# EAGLE design cp300_frehd (EAGLE 9.5.1)
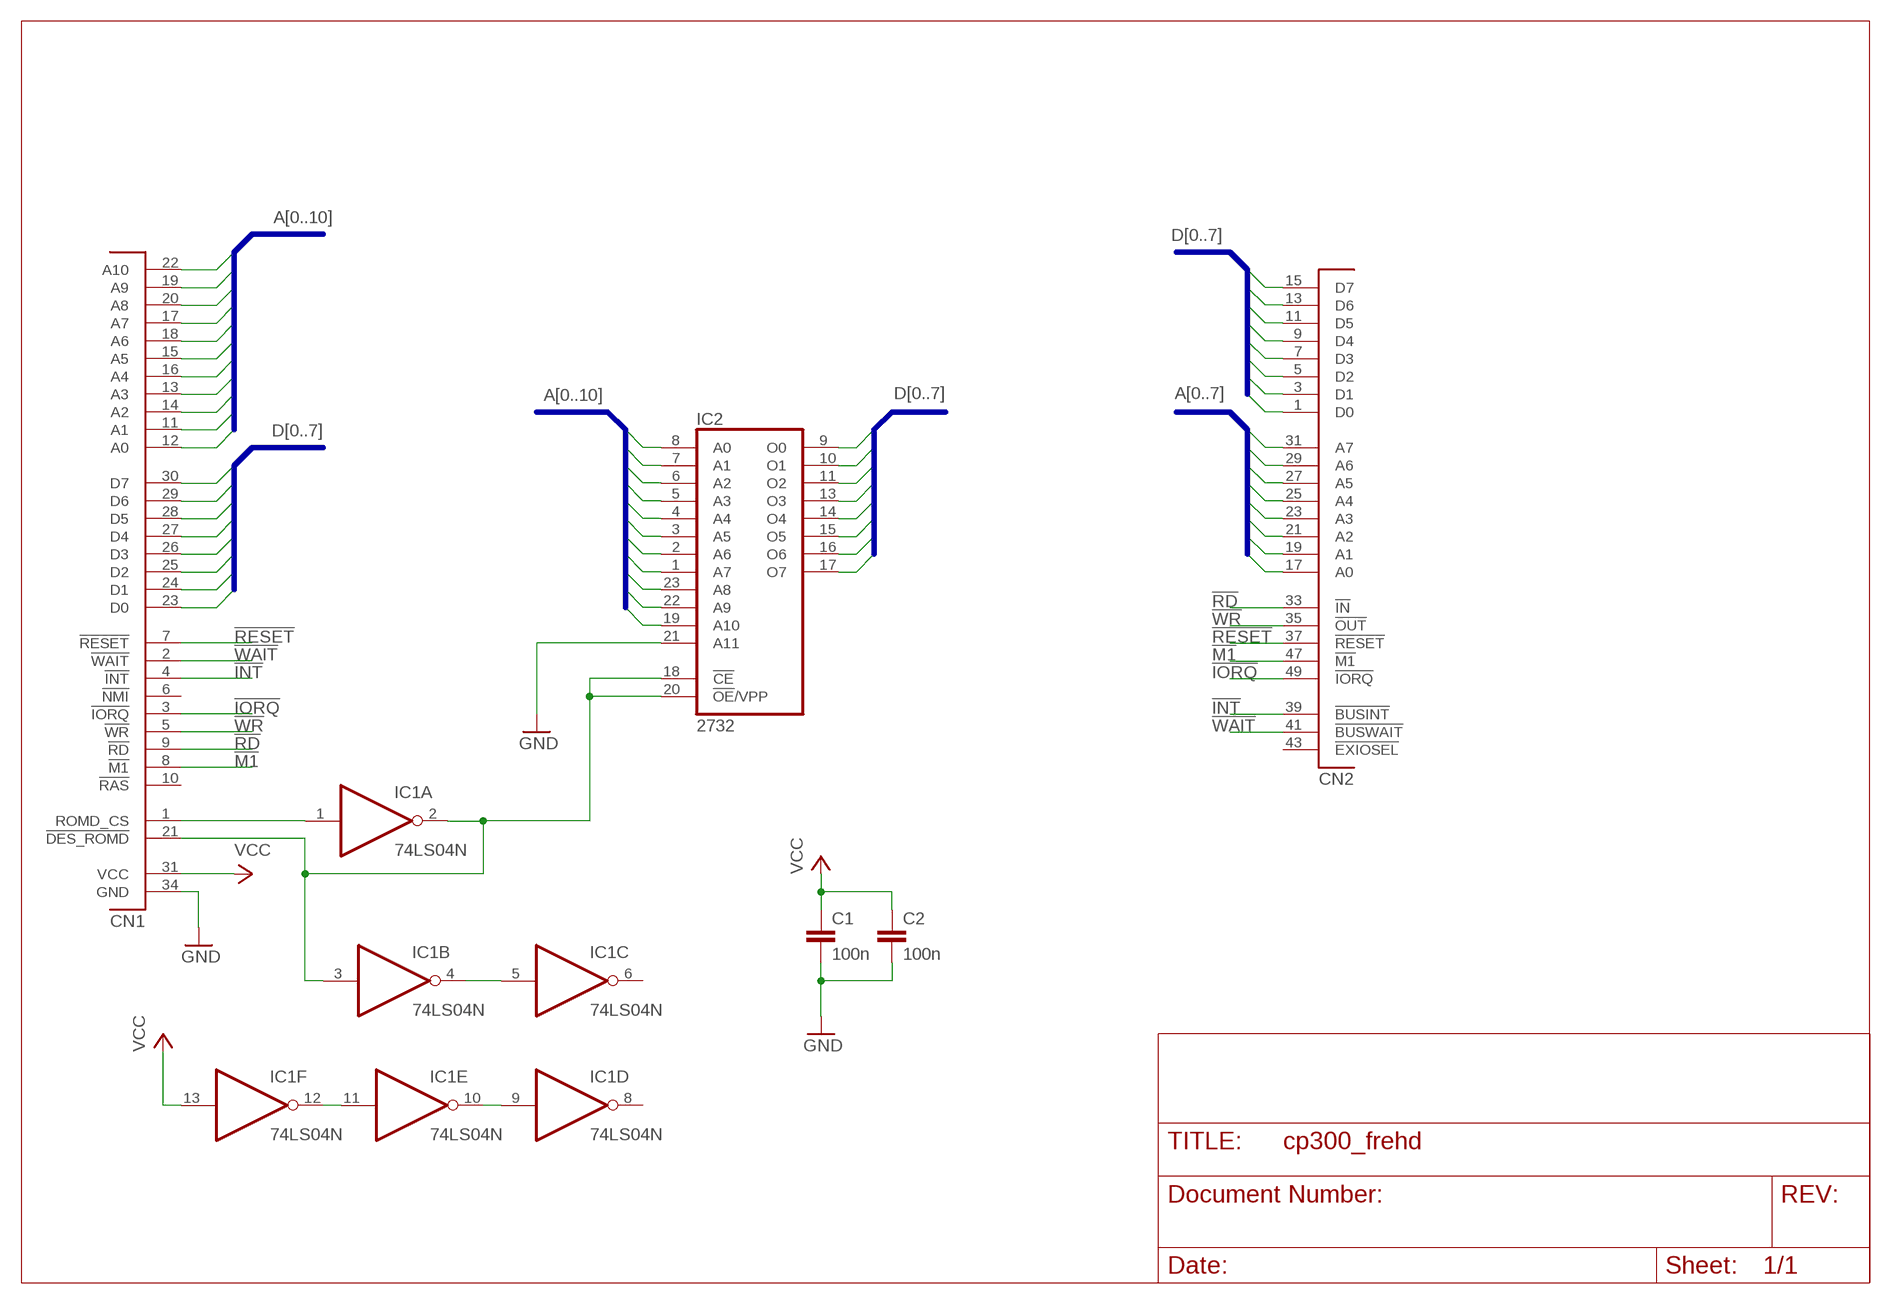
[diagram p0: schematic, sheet 1]

## Parts
C1  100n  C-EU050-024X044  [C050-024X044]
C2  100n  C-EU050-024X044  [C050-024X044]
CN1  CP300_EXPA  [2X17]
CN2  TRS80_EXPA  [2X25]
IC1  74LS04N  [DIL14]
IC2  2732  [DIL24]

## Nets
!INT: CN1.4(!INT) CN2.39(!BUSINT)
!IORQ: CN1.3(!IORQ) CN2.49(!IORQ)
!M1: CN1.8(!M1) CN2.47(!M1)
!RD: CN1.9(!RD) CN2.33(!IN)
!RESET: CN1.7(!RESET) CN2.37(!RESET)
!WAIT: CN1.2(!WAIT) CN2.41(!BUSWAIT)
!WR: CN1.5(!WR) CN2.35(!OUT)
A0: CN1.12(A0) CN2.17(A0) IC2.8(A0)
A1: CN1.11(A1) CN2.19(A1) IC2.7(A1)
A2: CN1.14(A2) CN2.21(A2) IC2.6(A2)
A3: CN1.13(A3) CN2.23(A3) IC2.5(A3)
A4: CN1.16(A4) CN2.25(A4) IC2.4(A4)
A5: CN1.15(A5) CN2.27(A5) CN2.29(A6) IC2.3(A5)
A6: CN1.18(A6) IC2.2(A6)
A7: CN1.17(A7) CN2.31(A7) IC2.1(A7)
A8: CN1.20(A8) IC2.23(A8)
A9: CN1.19(A9) IC2.22(A9)
A10: CN1.22(A10) IC2.19(A10)
D0: CN1.23(D0) CN2.1(D0) IC2.9(O0)
D1: CN1.24(D1) CN2.3(D1) IC2.10(O1)
D2: CN1.25(D2) CN2.5(D2) IC2.11(O2)
D3: CN1.26(D3) CN2.7(D3) IC2.13(O3)
D4: CN1.27(D4) CN2.9(D4) IC2.14(O4)
D5: CN1.28(D5) CN2.11(D5) IC2.15(O5)
D6: CN1.29(D6) CN2.13(D6) IC2.16(O6)
D7: CN1.30(D7) CN2.15(D7) IC2.17(O7)
GND [Power]: C1.2 C2.2 CN1.34(GND) IC2.21(A11)
N$3: IC1.11(E:I) IC1.12(F:O)
N$4: IC1.9(D:I) IC1.10(E:O)
N$5: IC1.4(B:O) IC1.5(C:I)
N$8: CN1.1(ROMD_CS) IC1.1(A:I)
N$9: CN1.21(!DES_ROMD) IC1.2(A:O) IC1.3(B:I) IC2.18(!CE) IC2.20(!OE!/VPP)
VCC [Power]: C1.1 C2.1 CN1.31(VCC) IC1.13(F:I)
Unconnected: CN1.6(!NMI) CN1.10(!RAS) CN2.43(!EXIOSEL) IC1.6(C:O) IC1.8(D:O)

## Buses
A[0..10]
D[0..7]
A[0..7]

## Power pins joined to a net without a drawn wire
GND: CN2.2(GND) CN2.4(GND) CN2.6(GND) CN2.8(GND) CN2.10(GND) CN2.12(GND) CN2.14(GND) CN2.16(GND) CN2.18(GND) CN2.20(GND) CN2.22(GND) CN2.24(GND) CN2.26(GND) CN2.28(GND) CN2.30(GND) CN2.32(GND) CN2.34(GND) CN2.36(GND) CN2.38(GND) CN2.40(GND) CN2.42(GND) CN2.44(GND) CN2.46(GND) CN2.48(GND) CN2.50(GND) IC1.7(P:GND) IC2.12(GND)
VCC: IC1.14(P:VCC) IC2.24(VCC)

## Library data of the parts
C1 C2 = rcl:C-EU: CAPACITOR, European symbol; SPICEPREFIX: C
CN1 = TRS80:CP300_EXP: Porta de expansão do CP-300
CN2 = TRS80:TRS80_EXP: Bus Expansao TRS-80 / CP500
IC1 = 74xx-us:74*04: Hex INVERTER
IC2 = memory:2732: MEMORY

## Net classes
0 default: width 0.305 mm
1 Power: width 0.508 mm

## Board
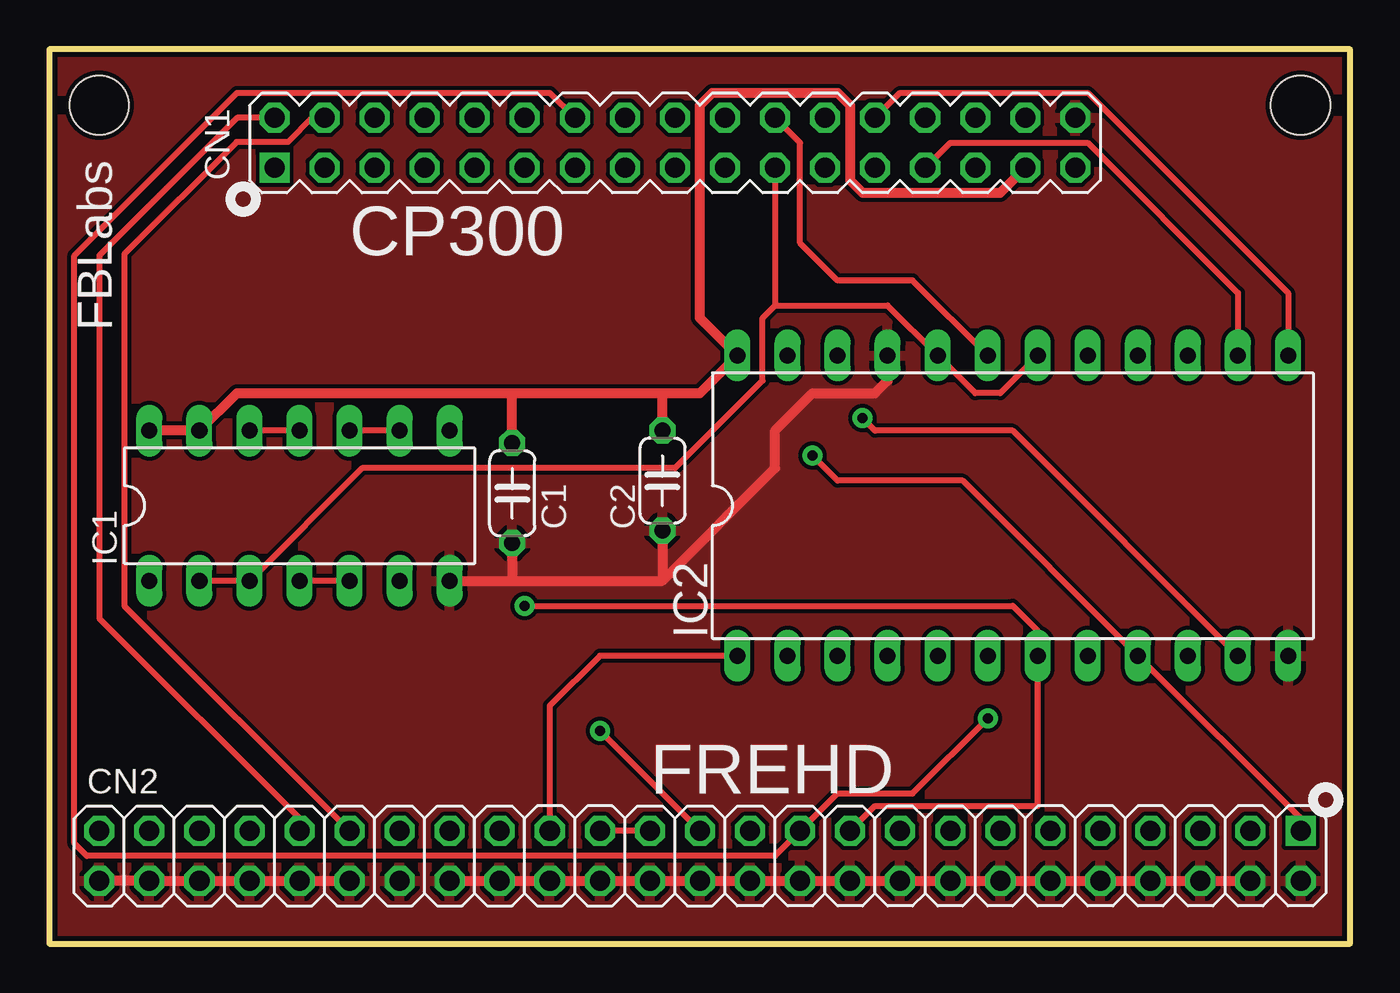
[diagram p1: board, top side]
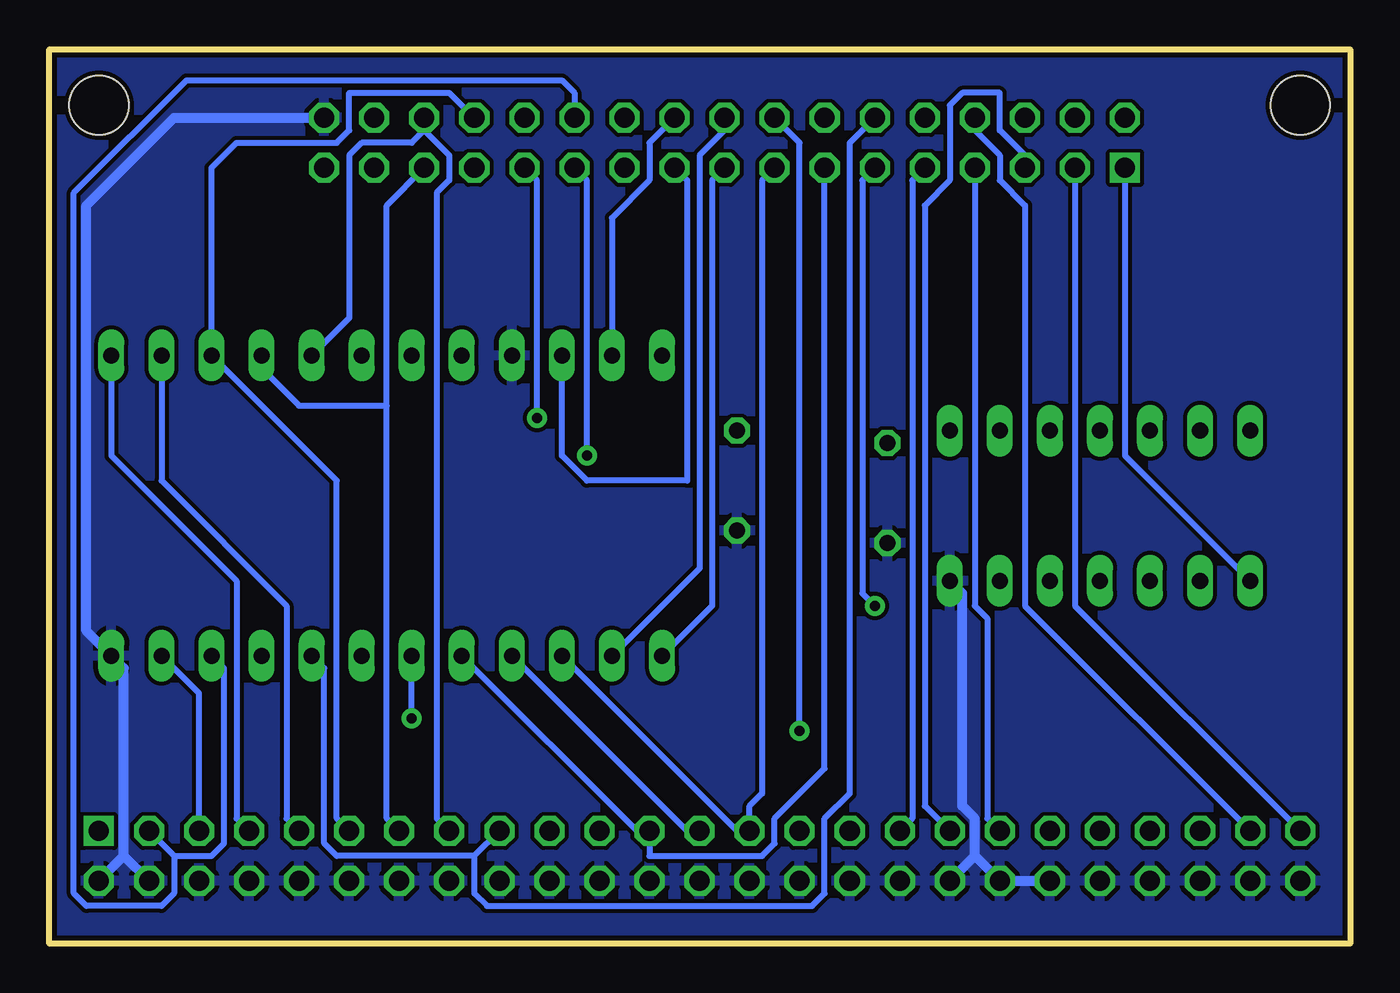
[diagram p2: board, bottom side, seen from below]

Size 66.02 x 45.39 mm. Coordinates in mm from the lower left corner, seen from the top.
Outline: 0,0 66.02,0 66.02,45.39 0,45.39 0,0
Copper layers (1*16): Top 0.035mm / dielectric 1.5mm / Bottom 0.035mm
Design rules "SparkFun(8mil)": minimum track width 10mil, minimum drill 20mil, track to track 8mil, track to pad 8mil, pad to pad 8mil, via to via 8mil, smd to smd 8mil, copper to edge 10mil, drill to drill 8mil, minimum pad ring 10mil, minimum via ring 10mil, stop-mask expansion 4mil, vias tented up to drill 25mil, thermal gap 10mil
Holes 3 mm at 2.54,42.55 63.5,42.55

### Footprints (pad centres in the part's own frame; a part is rotated, then mirrored left to right if it is on the bottom)
C050-024X044 = drill 0.813 octagon: 1 -2.54,0; 2 2.54,0
2X17 = drill 1.016 square: 1 -20.32,-1.27 | drill 1.016 octagon: 2 -20.32,1.27; 3 -17.78,-1.27; 4 -17.78,1.27; 5 -15.24,-1.27; 6 -15.24,1.27; 7 -12.7,-1.27; 8 -12.7,1.27; 9 -10.16,-1.27; 10 -10.16,1.27; 11 -7.62,-1.27; 12 -7.62,1.27; 13 -5.08,-1.27; 14 -5.08,1.27; 15 -2.54,-1.27; 16 -2.54,1.27; 17 0,-1.27; 18 0,1.27; 19 2.54,-1.27; 20 2.54,1.27; 21 5.08,-1.27; 22 5.08,1.27; 23 7.62,-1.27; 24 7.62,1.27; 25 10.16,-1.27; 26 10.16,1.27; 27 12.7,-1.27; 28 12.7,1.27; 29 15.24,-1.27; 30 15.24,1.27; 31 17.78,-1.27; 32 17.78,1.27; 33 20.32,-1.27; 34 20.32,1.27
2X25 = drill 1.016 square: 1 -30.48,-1.27 | drill 1.016 octagon: 2 -30.48,1.27; 3 -27.94,-1.27; 4 -27.94,1.27; 5 -25.4,-1.27; 6 -25.4,1.27; 7 -22.86,-1.27; 8 -22.86,1.27; 9 -20.32,-1.27; 10 -20.32,1.27; 11 -17.78,-1.27; 12 -17.78,1.27; 13 -15.24,-1.27; 14 -15.24,1.27; 15 -12.7,-1.27; 16 -12.7,1.27; 17 -10.16,-1.27; 18 -10.16,1.27; 19 -7.62,-1.27; 20 -7.62,1.27; 21 -5.08,-1.27; 22 -5.08,1.27; 23 -2.54,-1.27; 24 -2.54,1.27; 25 0,-1.27; 26 0,1.27; 27 2.54,-1.27; 28 2.54,1.27; 29 5.08,-1.27; 30 5.08,1.27; 31 7.62,-1.27; 32 7.62,1.27; 33 10.16,-1.27; 34 10.16,1.27; 35 12.7,-1.27; 36 12.7,1.27; 37 15.24,-1.27; 38 15.24,1.27; 39 17.78,-1.27; 40 17.78,1.27; 41 20.32,-1.27; 42 20.32,1.27; 43 22.86,-1.27; 44 22.86,1.27; 45 25.4,-1.27; 46 25.4,1.27; 47 27.94,-1.27; 48 27.94,1.27; 49 30.48,-1.27; 50 30.48,1.27
DIL14 = drill 0.813 long: 1 -7.62,-3.81; 2 -5.08,-3.81; 3 -2.54,-3.81; 4 0,-3.81; 5 2.54,-3.81; 6 5.08,-3.81; 7 7.62,-3.81; 8 7.62,3.81; 9 5.08,3.81; 10 2.54,3.81; 11 0,3.81; 12 -2.54,3.81; 13 -5.08,3.81; 14 -7.62,3.81
DIL24 = drill 0.813 long: 1 -13.97,-7.62; 2 -11.43,-7.62; 3 -8.89,-7.62; 4 -6.35,-7.62; 5 -3.81,-7.62; 6 -1.27,-7.62; 7 1.27,-7.62; 8 3.81,-7.62; 9 6.35,-7.62; 10 8.89,-7.62; 11 11.43,-7.62; 12 13.97,-7.62; 13 13.97,7.62; 14 11.43,7.62; 15 8.89,7.62; 16 6.35,7.62; 17 3.81,7.62; 18 1.27,7.62; 19 -1.27,7.62; 20 -3.81,7.62; 21 -6.35,7.62; 22 -8.89,7.62; 23 -11.43,7.62; 24 -13.97,7.62

### Placement (x,y rotation side)
C1  23.5,22.86 270 top
C2  31.11,23.5 270 top
CN1  31.75,40.64 0 top
CN2  33.02,4.45 180 top
IC1  12.7,22.23 0 top
IC2  48.9,22.23 0 top

### Tracks (layer width: path | path; a pad name or v marks a point on that pad's centre or on a via)
!INT
  Top 0.305: CN2.39 3.81,17.14 3.81,34.99 9.51,40.69 12.11,40.69 13.34,41.91 CN1.4
!IORQ
  Bottom 0.305: CN2.49 13.97,17.14 CN1.3
!M1
  Bottom 0.305: CN2.47 16.51,17.14 16.51,37.47 17.78,38.73 17.78,40.01 19.05,41.27 CN1.8
!RD
  Bottom 0.305: CN2.33 22.23,6.35 22.23,38.73 CN1.9
!RESET
  Bottom 0.305: CN2.37 18.41,6.35 18.41,16.51 19.05,17.14 CN1.7
!WAIT
  Top 0.305: CN2.41 12.7,6.35 2.54,16.51 2.54,34.92 9.53,41.91 CN1.2
!WR
  Bottom 0.305: CN2.35 21.59,6.99 21.59,37.47 20.32,38.73 20.32,42.55 19.68,43.18 17.78,43.18 17.78,41.27 16.51,40.01 CN1.5
A0
  Bottom 0.305: IC2.8 52.07,13.97 52.07,5.08 51.44,4.45 44.45,4.45 | CN2.17 44.45,4.45 | CN1.12 25.4,40.64 25.4,7.62 26.67,6.35 26.67,2.54 27.3,1.91 43.81,1.91 44.45,2.54 44.45,4.45
A1  (via drill 0.51)
  Top 0.305: CN2.19 41.91,6.99 50.16,6.99 IC2.7 50.16,15.88 48.9,17.14 v24.13,17.14
  Bottom 0.305: v24.13,17.14 24.77,17.78 24.77,38.73 CN1.11
A2  (via drill 0.51)
  Top 0.305: v47.62,11.43 43.81,7.62 40.01,7.62 CN2.21 36.83,4.45 1.91,4.45 1.27,5.08 1.27,34.92 9.53,43.18 25.4,43.18 CN1.14
  Bottom 0.305: v47.62,11.43 IC2.6
A3
  Bottom 0.305: IC2.5 36.2,5.71 CN2.23 35.56,4.45 29.84,4.45 29.21,5.08 29.21,6.35 26.67,8.89 CN1.13
A4  (via drill 0.51)
  Top 0.305: CN2.25 v27.94,10.79
  Bottom 0.305: IC2.4 33.66,5.71 CN2.25 | CN1.16 27.94,40.64 v27.94,10.79
A5
  Top 0.305: CN2.27 CN2.29
  Bottom 0.305: IC2.3 31.11,5.71 CN2.27 30.48,6.99 29.84,7.62 29.84,38.73 CN1.15
A6
  Bottom 0.305: IC2.2 33.02,19.05 33.02,40.01 31.75,41.27 CN1.18
A7
  Top 0.305: IC2.1 27.94,14.61 25.4,12.06 CN2.31
  Bottom 0.305: IC2.1 32.38,17.14 32.38,38.73 CN1.17
A8
  Bottom 0.305: IC2.23 37.47,36.83 35.56,38.73 35.56,40.64 CN1.20
A9
  Bottom 0.305: IC2.22 40.01,24.77 38.73,23.5 33.66,23.5 33.66,38.73 CN1.19
A10
  Top 0.305: CN1.22 38.1,40.64 38.1,35.56 40.01,33.66 43.81,33.66 IC2.19
D0  (via drill 0.51)
  Top 0.305: CN2.1 63.5,6.35 IC2.9 46.35,23.5 40.01,23.5 v38.73,24.77
  Bottom 0.305: CN1.23 38.73,38.73 v38.73,24.77
D1
  Bottom 0.305: IC2.10 57.15,13.97 57.15,5.08 57.78,4.45 59.69,4.45 | CN2.3 59.69,4.45 | CN1.24 39.37,43.18 40.01,43.81 59.05,43.81 64.77,38.1 64.77,2.54 64.14,1.91 60.33,1.91 59.69,2.54 59.69,4.45
D2  (via drill 0.51)
  Top 0.305: v41.27,26.67 41.91,26.04 48.9,26.04 IC2.11
  Bottom 0.305: IC2.11 58.42,12.7 CN2.5 | CN1.25 41.27,38.73 v41.27,26.67
D3
  Top 0.305: IC2.13 62.87,33.02 52.7,43.18 43.18,43.18 CN1.26
  Bottom 0.305: CN2.7 56.52,6.35 56.52,18.41 62.87,24.77 IC2.13
D4
  Top 0.305: IC2.14 60.33,33.02 52.7,40.64 45.72,40.64 CN1.27
  Bottom 0.305: CN2.9 53.98,6.35 53.98,17.14 60.33,23.5 IC2.14
D5
  Bottom 0.305: CN2.11 51.44,6.35 51.44,23.5 IC2.15 57.78,39.37 56.52,40.64 51.44,40.64 50.8,41.27 50.8,43.18 45.72,43.18 CN1.28
D6
  Bottom 0.305: 48.9,27.3 48.9,6.35 CN2.13 | 48.9,27.3 48.9,37.47 CN1.29 | IC2.16 55.24,29.21 53.34,27.3 48.9,27.3
D7
  Bottom 0.305: IC2.17 50.8,31.75 50.8,40.01 50.16,40.64 47.62,40.64 46.99,41.27 | CN2.15 46.35,6.35 46.35,38.1 45.72,38.73 45.72,40.01 46.99,41.27 | 46.99,41.27 CN1.30
GND
  Top 0.508: CN2.50 CN2.48 CN2.46 CN2.44 CN2.42 CN2.40 | IC1.7 23.5,18.41 | 23.5,18.41 31.11,18.41 | CN2.36 CN2.34 CN2.32 CN2.30 CN2.28 CN2.26 CN2.24 CN2.22 CN2.20 CN2.18 CN2.16 CN2.14 CN2.12 CN2.10 CN2.8 CN2.6 CN2.4 | 31.11,18.41 36.83,24.13 36.83,26.04 38.73,27.94 41.91,27.94 42.55,28.57 IC2.21 | C1.2 23.5,18.41 | C2.2 31.11,18.41
  Bottom 0.508: 62.23,4.45 62.23,13.97 IC2.12 64.14,15.88 64.14,37.47 59.69,41.91 CN1.34 | CN2.2 62.23,4.45 | 62.23,4.45 CN2.4 | IC1.7 19.68,17.78 19.68,6.99 19.05,6.35 19.05,4.45 | 19.05,4.45 CN2.38 CN2.40 | 19.05,4.45 CN2.36
  pour Top: -0.64,45.72 66.67,45.72 66.67,0 -0.64,0
  pour Bottom: -1.27,46.35 67.31,46.35 67.31,-0.64 -1.27,-0.64
N$3
  Top 0.305: IC1.11 IC1.12
N$4
  Top 0.305: IC1.9 IC1.10
N$5
  Top 0.305: IC1.5 IC1.4
N$8
  Bottom 0.305: IC1.1 11.43,24.77 CN1.1
N$9
  Top 0.305: IC1.2 IC1.3 15.88,24.13 31.75,24.13 36.2,28.57 36.2,31.75 36.83,32.38 | IC2.18 48.26,27.94 46.99,27.94 IC2.20 42.55,32.38 36.83,32.38 | CN1.21 36.83,32.38
VCC
  Top 0.508: IC1.14 IC1.13 9.53,27.94 23.5,27.94 | 23.5,27.94 31.11,27.94 | 31.11,27.94 33.02,27.94 IC2.24 33.02,31.75 33.02,42.55 33.66,43.18 40.01,43.18 40.64,42.55 40.64,38.73 41.27,38.1 48.26,38.1 CN1.31 | C1.1 23.5,27.94 | C2.1 31.11,27.94

### Text on the board
tPlace: CP300 | FBLabs | FREHD